# EAGLE schematic ADXL377 Breakout-v1.01 (EAGLE 6.4)
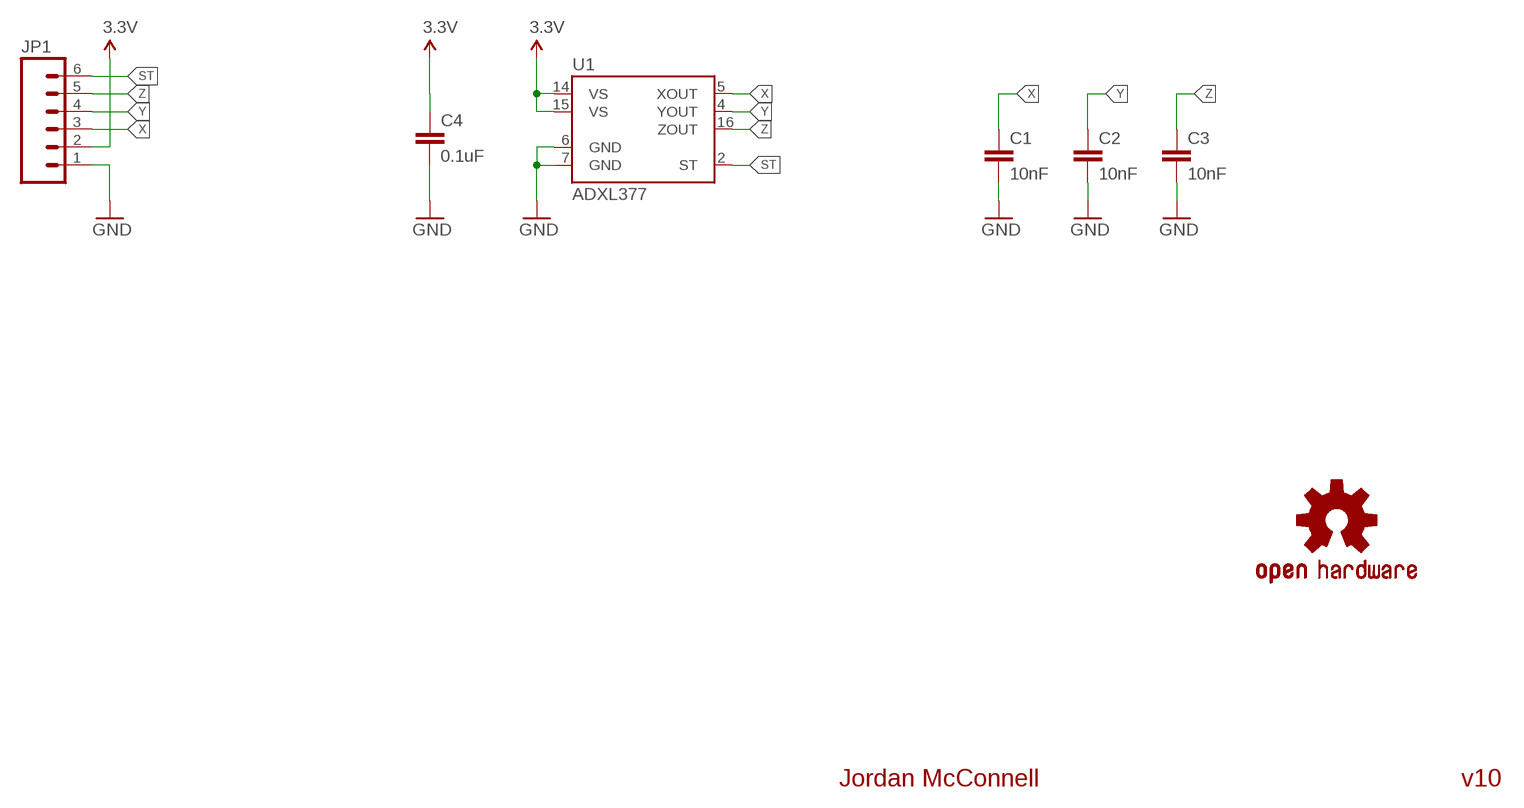
[diagram p0: schematic, sheet 1]

## Parts
C1  10nF  10NF/10000PF-50V-10%(0603)  [0603-CAP]
C2  10nF  10NF/10000PF-50V-10%(0603)  [0603-CAP]
C3  10nF  10NF/10000PF-50V-10%(0603)  [0603-CAP]
C4  0.1uF  0.1UF-25V(+80/-20%)(0603)  [0603-CAP]
JP1  M06SIP  [1X06]
LOGO2  OSHW-LOGOS  [OSHW-LOGO-S]
U1  ADXL377  [LFCSP_LQ-16]

## Nets
3.3V: C4.1 JP1.2 U1.14(VS) U1.15(VS)
GND: C1.2 C2.2 C3.2 C4.2 JP1.1 U1.6(GND) U1.7(GND)
ST: JP1.6 U1.2(ST)
X: C1.1 JP1.3 U1.5(XOUT)
Y: C2.1 JP1.4 U1.4(YOUT)
Z: C3.1 JP1.5 U1.16(ZOUT)

## Notes on the sheet
- Jordan McConnell | v10

## Library data of the parts
C1-C3 = SparkFun-Capacitors:10NF/10000PF-50V-10%(0603): CAP-00867; PROD_ID: CAP-00867
C4 = SparkFun-Capacitors:0.1UF-25V(+80/-20%)(0603): CAP-00810 Ceramic Standard decoupling cap; PROD_ID: CAP-00810
JP1 = SparkFun-Connectors:M06: Header 6 Standard 6-pin 0.1" header. Use with straight break away headers (SKU : PRT-00116), right angle break away headers (PRT-00553), swiss pins (PRT-00743), machine pins (PRT-00117), and female headers (PRT-00115). Molex polarized connector foot print use with SKU : PRT-08094 with associated crimp pins and housings. NOTES ON THE VARIANTS LOCK and LOCK_LONGPADS... This footprint was designed to help hold the alignment of a through-hole component (i.e. 6-pin header) while soldering it into place. You may notice that each hole has been shifted either up or down by 0.005 of an inch from it's more standard position (which is a perfectly straight line). This slight alteration caused the pins (the squares in the middle) to touch the edges of the holes. Because they are alternating, it causes a "brace" to hold the component in place. 0.005 has proven to be the perfect amount of "off-center" position when using our standard breakaway headers. Although looks a little odd when you look at the bare footprint, once you have a header in there, the alteration is very hard to notice. Also,if you push a header all the way into place, it is covered up entirely on the bottom side. This idea of altering the position of holes to aid alignment will be further integrated into the Sparkfun Library for other footprints. It can help hold any component with 3 or more connection pins.
LOGO2 = SparkFun-Aesthetics:OSHW-LOGO: Open Source Hardware Logo This logo indicates the piece of hardware it is found on incorporates a OSHW license and/or adheres to the definition of open source hardware found here: http://freedomdefined.org/OSHW
U1 = SparkFun-Sensors:ADXL377: ADXL377 Low Power 3-Axis ±200 g Accelerometer with Analog Output.